# Altium project bt-bezel-dvt2.PrjPcb
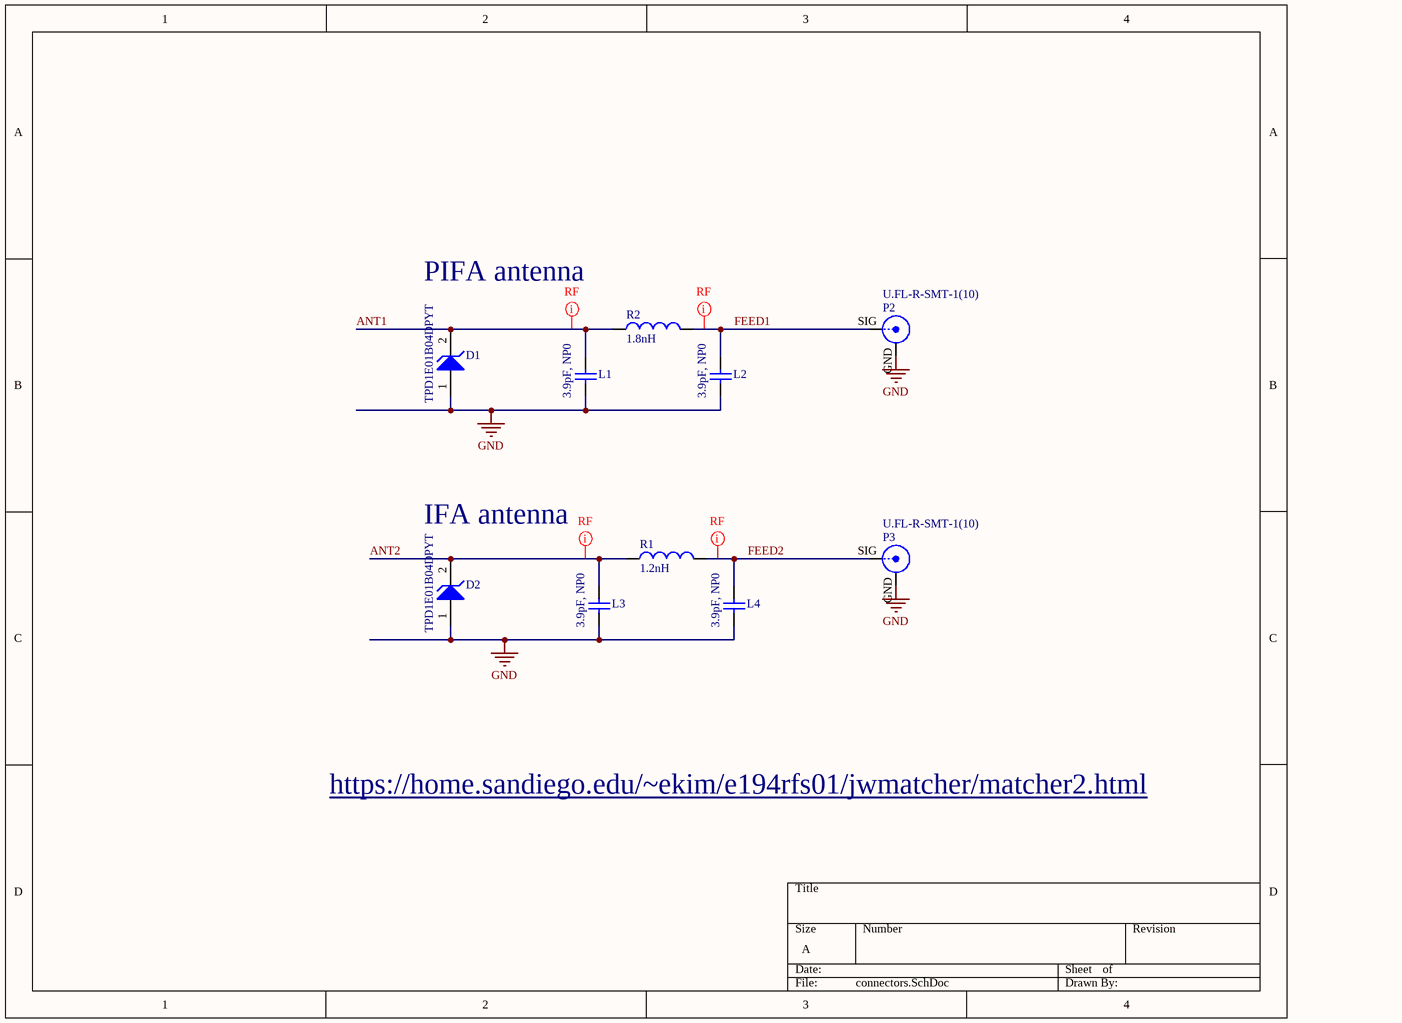
[diagram p0: connectors.SchDoc]
1 sheet, 10 parts. Net scope: global (net labels, ports and power ports of the same name join across sheets).
Board files: bt-bezel-dvt2-R.PcbDoc, bt-bezel-dvt2-Lb.PcbDoc

## Sheet connectors.SchDoc
size A

### Parts
D1  TPD1E01B04DPYT  [TI_PX1SON-N2]
D2  TPD1E01B04DPYT  [TI_PX1SON-N2]
L1  3.9pF, NP0  [B_CAP0402]
L2  3.9pF, NP0  [B_CAP0402]
L3  3.9pF, NP0  [B_CAP0402]
L4  3.9pF, NP0  [B_CAP0402]
P2  U.FL-R-SMT-1(10)  [HRS_U.FL]
P3  U.FL-R-SMT-1(10)  [HRS_U.FL]
R1  1.2nH  [B_IND0402]
R2  1.8nH  [B_IND0402]

### Nets
GND: D1.1(A) D2.1(A) L1.2 L2.2 L3.2 L4.2 P2.GND(Y) P3.GND(Y)
ANT1: D1.2(K) L1.1 R2.1
ANT2: D2.2(K) L3.1 R1.1
FEED1: L2.1 P2.SIG(X) R2.2
FEED2: L4.1 P3.SIG(X) R1.2

### Layout directives
net class RF: ANT1, ANT2, FEED1, FEED2

### Notes on the sheet
- PIFA antenna
- IFA antenna
- https://home.sandiego.edu/~ekim/e194rfs01/jwmatcher/matcher2.html

### Library data of the parts
D1 D2 = D Zener: CPDUR24V; VENDOR: TI; MYPN: D-TPD1E01B04DPYT; Published: 8-Jun-2000; LatestRevisionDate: 17-Jul-2002; LatestRevisionNote: Re-released for DXP Platform.; PackageReference: DIODE-0.7; Publisher: Altium Limited; PackageDescription: Diode, Thru-Hole; 2 Leads; 0.7 in Pin Spacing; MPN: TPD1E01B04DPYT
L1-L4 = Cap Semi: Capacitor (Semiconductor SIM Model); MPN: GRM0335C1H3R9BA01D; VENDOR: Murata; MYPN: C-3p9-50-NP0-0402
P2 P3 = BNC: BNC Elbow Connector; VENDOR: HRS; MYPN: J-U.FL-SMT; LatestRevisionDate: 17-Jul-2002; LatestRevisionNote: Re-released for DXP Platform.; Publisher: Altium Limited; MPN: U.FL-R-SMT-1(10)
R1 = Inductor: MPN: LQP15MN1N2W02D; Code_IEC: 1005; VENDOR: Murata; MYPN: L-1p8NH-0402; Published: 8-Jun-2000; LatestRevisionDate: 29-May-2009; LatestRevisionNote: IPC-7351 Footprint Added.; PackageReference: 0402-A; Publisher: Altium Limited; PackageDescription: Chip Inductor; Code_JEITA: 0402
R2 = Inductor: MPN: LQW15AN1N8C00D; Code_IEC: 1005; VENDOR: Murata; MYPN: L-1p8NH-0402; Published: 8-Jun-2000; LatestRevisionDate: 29-May-2009; LatestRevisionNote: IPC-7351 Footprint Added.; PackageReference: 0402-A; Publisher: Altium Limited; PackageDescription: Chip Inductor; Code_JEITA: 0402